# Altium project Si4825-Receiver.PrjPcb
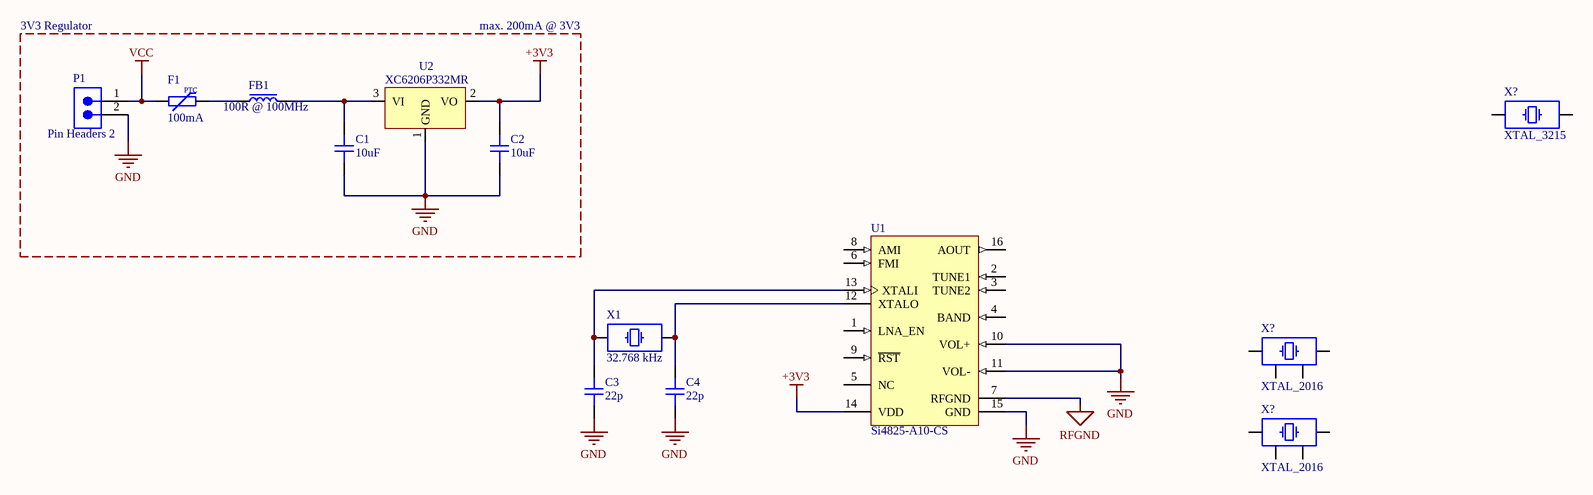
[diagram p0: Schematic.SchDoc]
1 sheet, 13 parts. Net scope: global (net labels, ports and power ports of the same name join across sheets).

## Sheet Schematic.SchDoc
size A4; SheetNumber: 1; SheetTotal: 1

### Parts
(Parts that share a designator on the sheet are numbered #1, #2 ... from top to bottom, then left to right.)
C1  10uF  [CAP_0603]
C2  10uF  [CAP_0603]
C3  22p  [CAP_0402]
C4  22p  [CAP_0402]
F1  100mA  [FUSE_1206]
FB1  100R @ 100MHz  [FB_0805]
P1  Pin Headers 2  [90120-0762]
U1  Si4825-A10-CS  [SLAB-SOIC-16-NB_M]
U2  XC6206P332MR  [SOT95P240X115-3N]
X1  32.768 kHz  [XTAL_3215-2]
X?#1  XTAL_3215  [XTAL_3215-2]
X?#2  XTAL_2016  [XTAL_2016]
X?#3  XTAL_2016  [XTAL_2016]

### Nets
+3V3: C2.1 U1.14(VDD) U2.2(VO)
GND: C1.2 C2.2 C3.1 C4.1 P1.2 U1.10(VOL+) U1.11(VOL-) U1.15(GND) U2.1(GND)
RFGND: U1.7(RFGND)
VCC: F1.1 P1.1
NetC1_1: C1.1 FB1.2 U2.3(VI)
NetC3_2: C3.2 U1.13(XTALI) X1.1
NetC4_2: C4.2 U1.12(XTALO) X1.2
NetF1_2: F1.2 FB1.1

Not connected (* = marked no-connect by the designer): U1 1(LNA_EN) 2(TUNE1) 3(TUNE2) 4(BAND) 5(NC) 6(FMI) 8(AMI) 9(~{RST}) 16(AOUT); X?#1 1 2; X?#2 1 2 3 4; X?#3 1 2 3 4

### Notes on the sheet
- 3V3 Regulator
- max. 200mA @ 3V3
- (in symbol FUSE_PPTC_1206) PTC

### Library data of the parts
C1 C2 = CAP_0603: Capacitor SMD 0603; Manufacturer: *; Manufacturer Part Number: *; Distributor Link: *; LCSC: *; Rating: *; Dielectric: *
C3 C4 = CAP_0402: Capacitor SMD 0402; Manufacturer: *; Manufacturer Part Number: *; Distributor Link: *; LCSC: *; Rating: *; Dielectric: *
F1 = FUSE_PPTC_1206: Fuse PPTC SMD 1206; Manufacturer: *; Manufacturer Part Number: *
FB1 = FB_0805: Ferrite Bead SMD 0805; Manufacturer: *; Manufacturer Part Number: *; Distributor Link: *; LCSC: *
P1 = CON-2-Header: Headers connector, 2.54mm Pitch, Single Row, 2-pin. Molex partnumber: 0120-0762.; Number of Pins: 2; Type: Header; Pitch: 2.54 mm
U1 = Si4825-A10: Broadcast Mechanical Tuning AM / FM / SW Radio Receiver, 0 to 70 degC, 16-pin SOIC, Tube; Manufacturer: Silicon Labs; Sub-Family: AM/FM, Shortwave, Longwave, Weather Band Receivers; RDS Support: FALSE; Mounting Technology: Surface Mount; ComponentLink1Description: Manufacturer URL; ComponentLink3Description: Package Specification; Code_JEDEC: MS-012; ComponentLink3URL: http://www.silabs.com/Support%20Documents/TechnicalDocs/si2401.pdf; ComponentLink2URL: http://www.silabs.com/Support Documents/TechnicalDocs/Si4825-A10.pdf; PartNumber: Si4825-A10-CS; ComponentLink2Description: Datasheet; DatasheetVersion: Rev. 1.0; PackageReference: SOIC-16-NB; ComponentLink1URL: http://www.silabs.com/; PackageDescription: 16-Pin Small-Outline Integrated Circuit, Body 9.9 x 3.9 mm, Pitch 1.27 mm; Code_IPC: J-STD-020
U2 = XC6206P332MR: Linear voltage regulator 250mA; / Output voltage: 1.5V~5.0V (step size 0.1V).
X1 X?#1 = XTAL_3215: Crystal SMD 3215; Distributor Link: *
X?#2 X?#3 = XTAL_2016: Crystal SMD 4-Pin 2.0x1.6mm; Distributor Link: *